# EAGLE schematic modemIO_v1 (EAGLE 6.2)
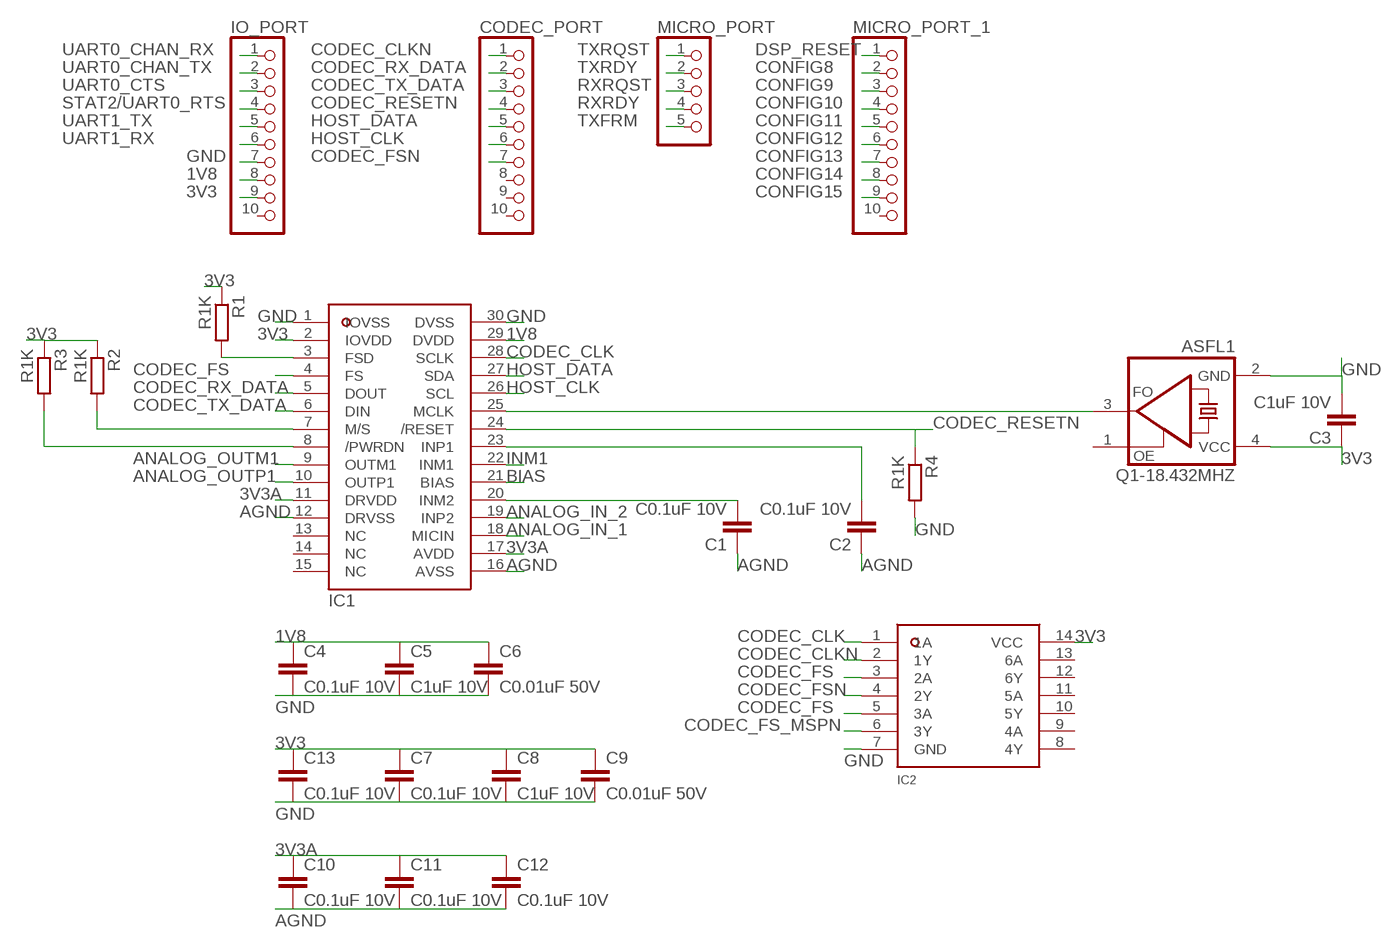
[diagram p0: schematic, sheet 1]

## Parts
C1  C0.1uF 10V  C-EUC0805  [C0805]
C2  C0.1uF 10V  C-EUC0805  [C0805]
C3  C1uF 10V  C-EUC0805  [C0805]
C4  C0.1uF 10V  C-EUC0805  [C0805]
C5  C1uF 10V  C-EUC0805  [C0805]
C6  C0.01uF 50V  C-EUC0805  [C0805]
C7  C0.1uF 10V  C-EUC0805  [C0805]
C8  C1uF 10V  C-EUC0805  [C0805]
C9  C0.01uF 50V  C-EUC0805  [C0805]
C10  C0.1uF 10V  C-EUC0805  [C0805]
C11  C0.1uF 10V  C-EUC0805  [C0805]
C12  C0.1uF 10V  C-EUC0805  [C0805]
C13  C0.1uF 10V  C-EUC0805  [C0805]
CODEC_PORT  PINHD-1X10  [1X10]
IC1  TLV320AIC14R-PDSO-G30  [R-PDSO-G30]
IC2  SN74LVC04ADRR-PDSO-G14  [R-PDSO-G14]
IO_PORT  PINHD-1X10  [1X10]
MICRO_PORT  PINHD-1X5  [1X05]
MICRO_PORT_1  PINHD-1X10  [1X10]
Q1-18.432MHZ  ASFL1  [ASF]
R1  R1K  R-EU_R0805  [R0805]
R2  R1K  R-EU_R0805  [R0805]
R3  R1K  R-EU_R0805  [R0805]
R4  R1K  R-EU_R0805  [R0805]

## Nets
1V8: C4.1 C5.1 C6.1 IC1.29(DVDD) IO_PORT.8
3V3: C3.1 C7.1 C8.1 C9.1 C13.1 IC1.2(IOVDD) IC2.14(VCC) IO_PORT.9 Q1-18.432MHZ.4(VCC) R1.1 R2.1 R3.1
3V3A: C10.1 C11.1 C12.1 IC1.11(DRVDD) IC1.17(AVDD)
AGND: C1.1 C2.1 C10.2 C11.2 C12.2 IC1.12(DRVSS) IC1.16(AVSS)
ANALOG_IN_1: IC1.18(MICIN)
ANALOG_IN_2: IC1.19(INP2)
ANALOG_OUTM1: IC1.9(OUTM1)
ANALOG_OUTP1: IC1.10(OUTP1)
BIAS: IC1.21(BIAS)
CODEC_CLK: IC1.28(SCLK) IC2.1(1A)
CODEC_CLKN: CODEC_PORT.1 IC2.2(1Y)
CODEC_FS: IC1.4(FS) IC2.3(2A) IC2.5(3A)
CODEC_FS_MSPN: IC2.6(3Y)
CODEC_FSN: CODEC_PORT.7 IC2.4(2Y)
CODEC_RESETN: CODEC_PORT.4 IC1.24(/RESET) R4.1
CODEC_RX_DATA: CODEC_PORT.2 IC1.5(DOUT)
CODEC_TX_DATA: CODEC_PORT.3 IC1.6(DIN)
CONFIG8: MICRO_PORT_1.2
CONFIG9: MICRO_PORT_1.3
CONFIG10: MICRO_PORT_1.4
CONFIG11: MICRO_PORT_1.5
CONFIG12: MICRO_PORT_1.6
CONFIG13: MICRO_PORT_1.7
CONFIG14: MICRO_PORT_1.8
CONFIG15: MICRO_PORT_1.9
DSP_RESET: MICRO_PORT_1.1
GND: C3.2 C5.2 C6.2 C7.2 C8.2 C9.2 C13.2 IC1.1(IOVSS) IC1.30(DVSS) IC2.7(GND) IO_PORT.7 Q1-18.432MHZ.2(GND) R4.2
HOST_CLK: CODEC_PORT.6 IC1.26(SCL)
HOST_DATA: CODEC_PORT.5 IC1.27(SDA)
INM1: IC1.22(INM1)
N$3: IC1.3(FSD) R1.2
N$7: IC1.7(M/S) R2.2
N$8: IC1.8(/PWRDN) R3.2
N$17: C1.2 IC1.20(INM2)
N$20: C2.2 IC1.23(INP1)
N$22: IC1.25(MCLK) Q1-18.432MHZ.3(FO)
RXRDY: MICRO_PORT.4
RXRQST: MICRO_PORT.3
STAT2/UART0_RTS: IO_PORT.4
TXFRM: MICRO_PORT.5
TXRDY: MICRO_PORT.2
TXRQST: MICRO_PORT.1
UART0_CHAN_RX: IO_PORT.1
UART0_CHAN_TX: IO_PORT.2
UART0_CTS: IO_PORT.3
UART1_RX: IO_PORT.6
UART1_TX: IO_PORT.5
Unconnected: C4.2 CODEC_PORT.8 CODEC_PORT.9 CODEC_PORT.10 IC1.13(NC) IC1.14(NC) IC1.15(NC) IC2.8(4Y) IC2.9(4A) IC2.10(5Y) IC2.11(5A) IC2.12(6Y) IC2.13(6A) IO_PORT.10 MICRO_PORT_1.10 Q1-18.432MHZ.1(OE)

## Library data of the parts
C1-C13 = resistor:C-EU: CAPACITOR, European symbol
CODEC_PORT IO_PORT MICRO_PORT_1 = pinhead:PINHD-1X10: PIN HEADER
IC1 = TLV320AIC14:TLV320AIC14
IC2 = SN74LVC04ADR:SN74LVC04ADR
MICRO_PORT = pinhead:PINHD-1X5: PIN HEADER
Q1-18.432MHZ = crystal:ASF*: CRYSTAL CLOCK OSCILLATORS 5.0 Vdc or 3.3 Vdc - LOW PROFILE ULTRA MINIATURE CERAMIC SURFACE MOUNT Source: http://www.abracon.com/Oscillators/asf1-L-L1.pdf; MF: Abracon Corporation; MPN: ASFL1-125.000MHZ-EC-T; OC_FARNELL: 1838931; OC_NEWARK: 19M1882
R1-R4 = resistor:R-EU_: RESISTOR, European symbol